# Altium project StandaloneLeakDetector.PrjPcb
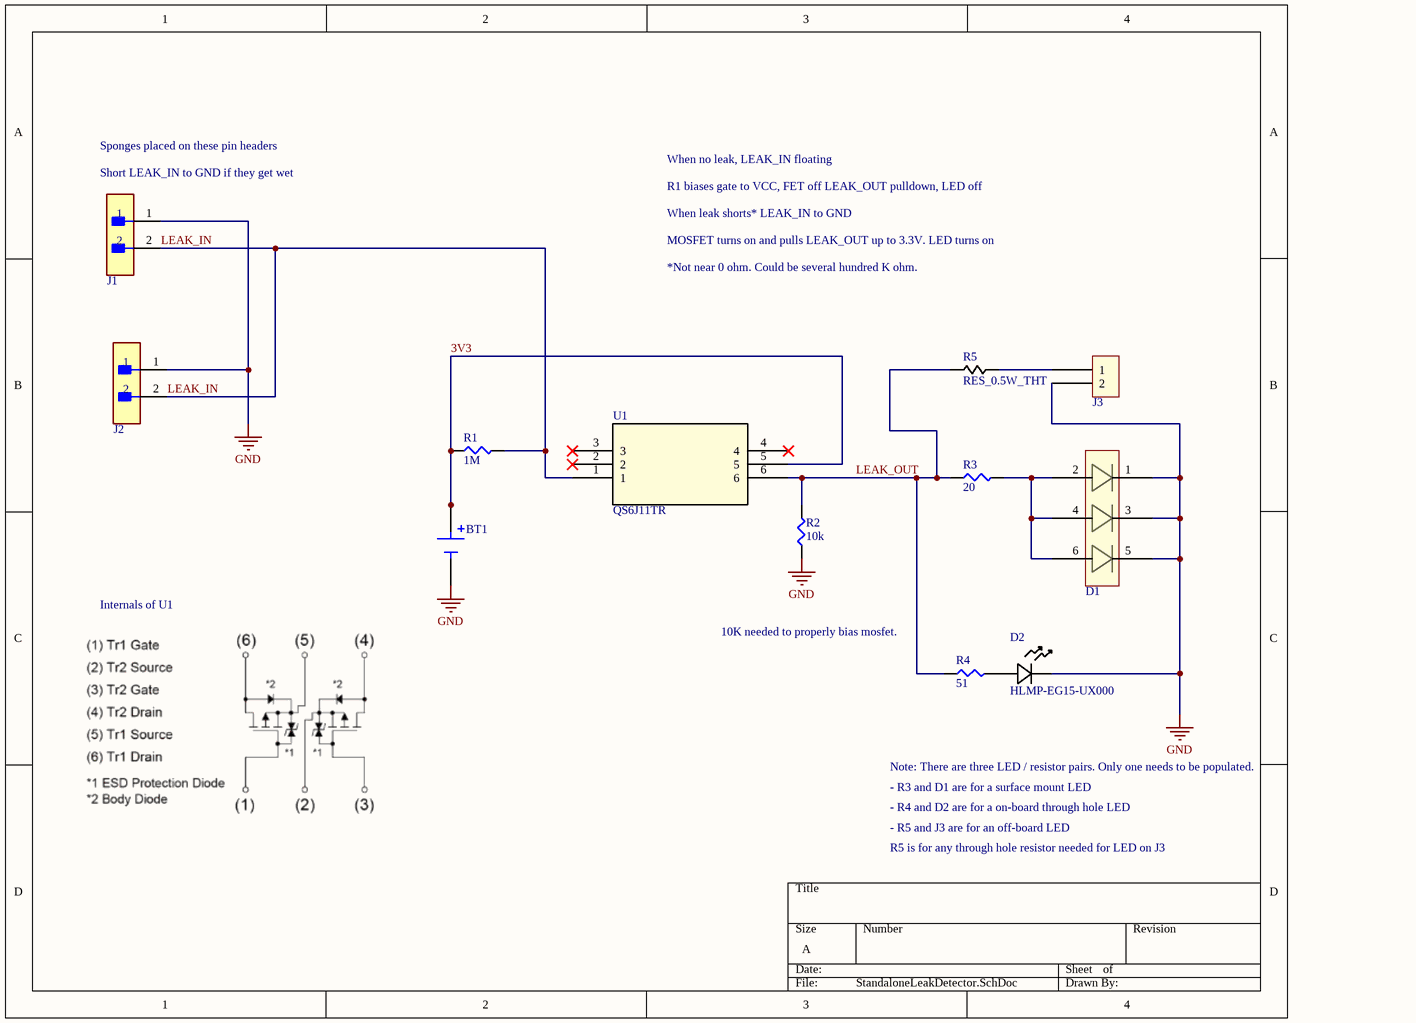
[diagram p0: StandaloneLeakDetector.SchDoc]
1 sheet, 12 parts. Net scope: global (net labels, ports and power ports of the same name join across sheets).
Board file: StandaloneLeakDetector.PcbDoc

## Sheet StandaloneLeakDetector.SchDoc
size A; SheetNumber: 1; SheetTotal: 1

### Parts
BT1  BAT-HLD-005-THM  [BAT_BAT-HLD-005-THM]  (value not drawn)
D1  SMTL6-RC  [SMTL6-RC]  (value not drawn)
D2  HLMP-EG15-UX000  [LED_AVAGO_HLMP_XX15_AVA]
J1  TSW-102-07-L-S  [FP-TSW-102-07-L-S-MFG]  (value not drawn)
J2  TSW-102-07-L-S  [FP-TSW-102-07-L-S-MFG]  (value not drawn)
J3  Header  [1x2 Header]  (value not drawn)
R1  1M  [SMD-0805-RES]
R2  10k  [SMD-0805-RES]
R3  20  [SMD-0805-RES]
R4  51  [SMD-0805-RES]
R5  RES_0.5W_THT  [RES_0.5W_THT]
U1  QS6J11TR  [TRANS_QS6_ROM]

### Nets
GND: BT1.N(NEG) D1.1 D1.3 D1.5 D2.1 J1.1 J2.1 J3.2 R2.1
3V3: BT1.P1(POS) BT1.P2(POS) R1.1 U1.5
LEAK_IN: J1.2 J2.2 R1.2 U1.1
LEAK_OUT: R2.2 R3.1 R4.1 R5.1 U1.6
NetD1_2: D1.2 D1.4 D1.6 R3.2
NetD2_2: D2.2 R4.2
NetJ3_1: J3.1 R5.2

Not connected (* = marked no-connect by the designer): U1 2* 3* 4*

### Notes on the sheet
- Sponges placed on these pin headers
- When no leak, LEAK_IN floating
- (near J1) Short LEAK_IN to GND if they get wet
- R1 biases gate to VCC, FET off LEAK_OUT pulldown, LED off
- When leak shorts* LEAK_IN to GND
- MOSFET turns on and pulls LEAK_OUT up to 3.3V. LED turns on
- *Not near 0 ohm. Could be several hundred K ohm.
- Internals of U1
- (near R4) 10K needed to properly bias mosfet.
- Note: There are three LED / resistor pairs. Only one needs to be populated.
- - R3 and D1 are for a surface mount LED
- - R4 and D2 are for a on-board through hole LED
- - R5 and J3 are for an off-board LED
- R5 is for any through hole resistor needed for LED on J3

### Library data of the parts
BT1 = BAT-HLD-005-THM: Battery Retainer Coin, 20.0mm 1 Cell PC Pin; MF: Linx Technologies Inc.; Availability: In Stock; Package: None; Check_prices: https://www.snapeda.com/parts/BAT-HLD-005-THM/Linx/view-part/?ref=eda; Price: None; SnapEDA_Link: https://www.snapeda.com/parts/BAT-HLD-005-THM/Linx/view-part/?ref=snap; MP: BAT-HLD-005-THM; Value: *; Purchase-URL: https://pricing.snapeda.com/search/part/BAT-HLD-005-THM/?ref=eda
D2 = HLMP-EG15-UX000: No Description Available; Mfr_Name: Avago Technologies; Type: DEV; Copyright: Copyright (C) 2022 Ultra Librarian. All rights reserved.; Manufacturer_Part_Number: HLMP-EG15-UX000; Digi-Key_Part_Number_1: HLMP-EG15-UX000-ND; Digi-Key_Part_Number_2: 516-HLMP-EG15-UX000-ND; RefDes: RefDes
J1 J2 = CMP-02766-001428-1: CONN HEADER VERT 2POS 2.54MM; Voltage Rating: 550V; Current Rating: 7.6A; Gender: Male; Number of Contacts: 2; Connector Type: Male Pin; Radiation Hardening: No; Orientation: Straight; Contact Plating: Gold; Max Operating Temperature: 125°C; Mount: Through Hole; Package Quantity: 1; Number of Rows: 1; Housing Material: Polyester; RoHS Compliant: Yes; Length: 5.08mm; Max Voltage Rating (AC): 550V; Pitch: 2.54mm; Packaging: Bulk; Depth: 2.54mm; Termination: Solder; Min Operating Temperature: -55°C; Housing Color: Black; Lead Free: Lead Free; Color: Black; Number of Positions: 2; Width: 2.54mm; Max Current Rating: 7.6A; REACH SVHC: No SVHC; Contact Material: Bronze; Contact Mating Length: 0.23inch; Series: TSW; Contact Type: Male Pin
J3 = 1x2 Header: CONN HEADER VERT 2POS 2.54MM
R1 = ERJ-6ENF1004V: RES SMD 1M OHM 1% 1/8W 0805; Manufacturer: Panasonic Electronic Components; Factory Stock: 0; Unit Price (USD): 0.00729; @ qty: 1500; Minimum Quantity: 1; Power (Watts): 0.125W, 1/8W; Temperature Coefficient: ±100ppm/°C; Part Number: ERJ-6ENF1004V; Datasheets: http://industrial.panasonic.com/www-cgi/jvcr13pz.cgi?E+PZ+3+AOA0002+ERJ6ENF1004V+7+WW; Image: //media.digikey.com/Renders/Panasonic%20Renders/ERJ-0805%20Pkg.jpg; Digi-Key Part Number: P1.00MCCT-ND; Quantity Available: 710452; Packaging: Cut Tape (CT); Series: ERJ; Part Status: Active; Value: 1M; Tolerance: ±1%; Composition: Thick Film; Features: Automotive AEC-Q200; Operating Temperature: -55°C ~ 155°C; Package / Case: 0805 (2012 Metric); Supplier Device Package: 0805; Size / Dimension: 0.079" L x 0.049" W (2.00mm x 1.25mm); Height - Seated (Max): 0.028" (0.70mm); Number of Terminations: 2; Failure Rate: -
R2 = ERJ-6ENF1002V: RES SMD 10K OHM 1% 1/8W 0805; Manufacturer: Panasonic Electronic Components; Factory Stock: 0; Unit Price (USD): 0.00729; @ qty: 1500; Minimum Quantity: 1; Power (Watts): 0.125W, 1/8W; Temperature Coefficient: ±100ppm/°C; Part Number: ERJ-6ENF1002V; Datasheets: http://industrial.panasonic.com/www-cgi/jvcr13pz.cgi?E+PZ+3+AOA0002+ERJ6ENF1002V+7+WW; Image: //media.digikey.com/Renders/Panasonic%20Renders/ERJ-0805%20Pkg.jpg; Digi-Key Part Number: P10.0KCCT-ND; Quantity Available: 3985614; Packaging: Cut Tape (CT); Series: ERJ; Part Status: Active; Value: 10k; Tolerance: ±1%; Composition: Thick Film; Features: Automotive AEC-Q200; Operating Temperature: -55°C ~ 155°C; Package / Case: 0805 (2012 Metric); Supplier Device Package: 0805; Size / Dimension: 0.079" L x 0.049" W (2.00mm x 1.25mm); Height - Seated (Max): 0.028" (0.70mm); Number of Terminations: 2; Failure Rate: -
R3 = ERJ-6ENF20R0V: RES SMD 20 OHM 1% 1/8W 0805; Manufacturer: Panasonic Electronic Components; Factory Stock: 0; Unit Price (USD): 0.00729; @ qty: 1500; Minimum Quantity: 1; Power (Watts): 0.125W, 1/8W; Temperature Coefficient: ±100ppm/°C; Part Number: ERJ-6ENF20R0V; Datasheets: http://industrial.panasonic.com/www-cgi/jvcr13pz.cgi?E+PZ+3+AOA0002+ERJ6ENF20R0V+7+WW; Image: //media.digikey.com/Renders/Panasonic%20Renders/ERJ-0805%20Pkg.jpg; Digi-Key Part Number: P20.0CCT-ND; Quantity Available: 328732; Packaging: Cut Tape (CT); Series: ERJ; Part Status: Active; Value: 20; Tolerance: ±1%; Composition: Thick Film; Features: Automotive AEC-Q200; Operating Temperature: -55°C ~ 155°C; Package / Case: 0805 (2012 Metric); Supplier Device Package: 0805; Size / Dimension: 0.079" L x 0.049" W (2.00mm x 1.25mm); Height - Seated (Max): 0.028" (0.70mm); Number of Terminations: 2; Failure Rate: -
R4 = ERJ-6GEYJ510V: RES SMD 51 OHM 5% 1/8W 0805; Manufacturer: Panasonic Electronic Components; Factory Stock: 0; Unit Price (USD): 0.00496; @ qty: 1500; Minimum Quantity: 1; Power (Watts): 0.125W, 1/8W; Temperature Coefficient: ±200ppm/°C; Part Number: ERJ-6GEYJ510V; Datasheets: http://industrial.panasonic.com/www-cgi/jvcr13pz.cgi?E+PZ+3+AOA0001+ERJ6GEYJ510V+7+WW; Image: //media.digikey.com/Renders/Panasonic%20Renders/ERJ-0805%20Pkg.jpg; Digi-Key Part Number: P51ACT-ND; Quantity Available: 280102; Packaging: Cut Tape (CT); Series: ERJ; Part Status: Active; Value: 51; Tolerance: ±5%; Composition: Thick Film; Features: Automotive AEC-Q200; Operating Temperature: -55°C ~ 155°C; Package / Case: 0805 (2012 Metric); Supplier Device Package: 0805; Size / Dimension: 0.079" L x 0.049" W (2.00mm x 1.25mm); Height - Seated (Max): 0.028" (0.70mm); Number of Terminations: 2; Failure Rate: -
R5 = RES_0.5W_THT: Generic 0.5W through hole resistor
U1 = QS6J11TR: No Description Available; Mfr_Name: ROHM Semiconductor; Copyright: Copyright (C) 2022 Ultra Librarian. All rights reserved.; Manufacturer_Part_Number: QS6J11TR; Digi-Key_Part_Number_1: QS6J11CT-ND; Digi-Key_Part_Number_2: QS6J11DKR-ND; Digi-Key_Part_Number_3: QS6J11TR-ND; RefDes: RefDes; Type: DEV